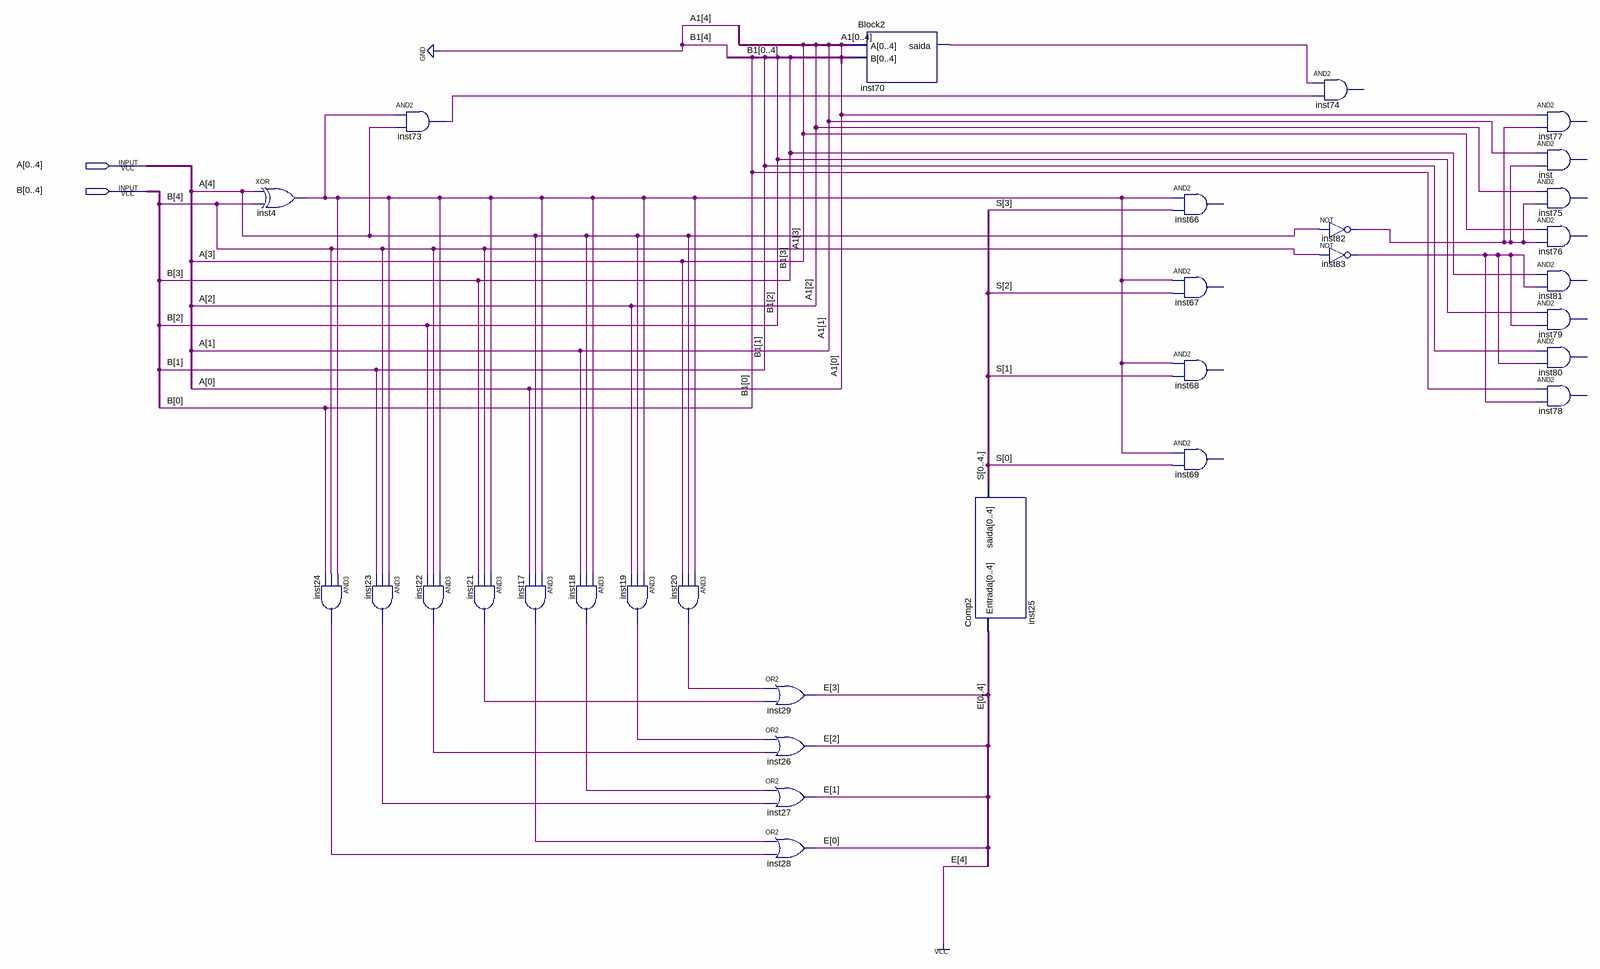
[diagram p0: schematic sheet]
// Quartus schematic somador5bits.bdf as structural Verilog: 31 symbols, 2 pins
module somador5bits (
  input  [0:4] A,
  input  [0:4] B
);

  wire inst4_out, inst17_out, inst18_out, inst19_out, inst20_out, inst21_out, inst22_out, inst23_out,
       inst24_out, inst70_saida, inst73_out, inst82_out, inst83_out, \S[0..4.] ;
  wire [3:0] E, S;

  xor inst4 (inst4_out, A[4], B[4]);
  and inst24 (inst24_out, inst4_out, B[4], B[0]);
  and inst73 (inst73_out, inst4_out, A[4]);
  and inst23 (inst23_out, inst4_out, B[4], B[1]);
  and inst22 (inst22_out, inst4_out, B[4], B[2]);
  and inst21 (inst21_out, inst4_out, B[4], B[3]);
  and inst17 (inst17_out, inst4_out, A[4], A[0]);
  and inst18 (inst18_out, inst4_out, A[4], A[1]);
  and inst19 (inst19_out, inst4_out, A[4], A[2]);
  and inst20 (inst20_out, inst4_out, A[4], A[3]);
  or inst29 (E[3], inst20_out, inst21_out);
  or inst26 (E[2], inst19_out, inst22_out);
  or inst27 (E[1], inst18_out, inst23_out);
  or inst28 (E[0], inst17_out, inst24_out);
  Block2 inst70 (.A({A[0:3], 1'b0}), .B({B[0:3], 1'b0}), .saida(inst70_saida));
  Comp2 inst25 (.Entrada({E[0], E[1], E[2], E[3], 1'b1}), .saida(\S[0..4.] ));
  // AND2 inst66 has open pins: IN1=inst4_out, IN2=S[3], OUT=open
  // AND2 inst67 has open pins: IN1=inst4_out, IN2=S[2], OUT=open
  // AND2 inst68 has open pins: IN1=inst4_out, IN2=S[1], OUT=open
  // AND2 inst69 has open pins: IN1=inst4_out, IN2=S[0], OUT=open
  // AND2 inst74 has open pins: IN1=inst70_saida, IN2=inst73_out, OUT=open
  not inst82 (inst82_out, A[4]);
  not inst83 (inst83_out, B[4]);
  // AND2 inst77 has open pins: IN1=A[0], IN2=inst82_out, OUT=open
  // AND2 inst has open pins: IN1=A[1], IN2=inst82_out, OUT=open
  // AND2 inst75 has open pins: IN1=A[2], IN2=inst82_out, OUT=open
  // AND2 inst76 has open pins: IN1=A[3], IN2=inst82_out, OUT=open
  // AND2 inst81 has open pins: IN1=B[3], IN2=inst83_out, OUT=open
  // AND2 inst79 has open pins: IN1=B[2], IN2=inst83_out, OUT=open
  // AND2 inst80 has open pins: IN1=B[1], IN2=inst83_out, OUT=open
  // AND2 inst78 has open pins: IN1=B[0], IN2=inst83_out, OUT=open

  // Other names for the same wires on the sheet: A1[3:0] = {A[3], A[2], A[1], A[0]};
  //   B1[3:0] = {B[3], B[2], B[1], B[0]}
endmodule
